# Altium schematic sheet KNoT-Gateway Starter Board.SchDoc: KNoT Gateway Starter Board
size A4; Organization: C.E.S.A.R; Address1: Rua Bione, 220; Address2: Bairro do Recife; Address3: Recife - PE - Brasil; Address4: 50030-390; Revision: 01.00-D01; SheetNumber: 1; SheetTotal: 1
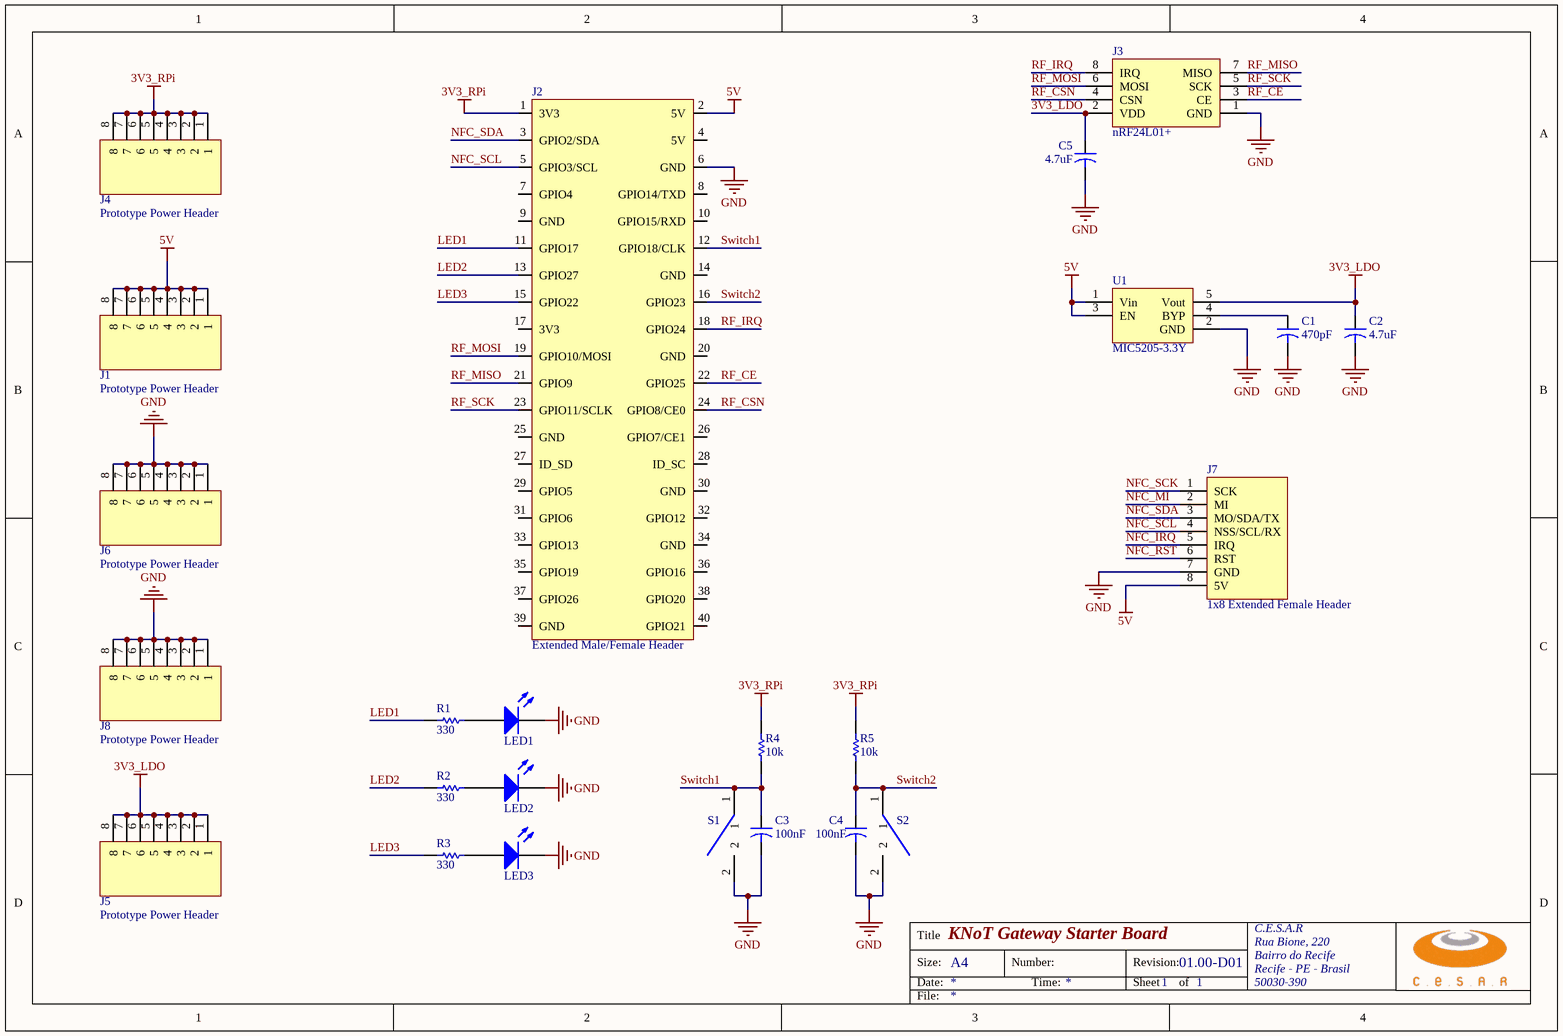
[diagram p0: KNoT-Gateway Starter Board.SchDoc]

## Parts
C1  value 470pF  [CAPC1608L]  (hidden comment: Cap0603)
C2  value 4.7uF  [CAPC1608L]  (hidden comment: Cap0603)
C3  value 100nF  [CAPC1608L]  (hidden comment: Cap0603)
C4  value 100nF  [CAPC1608L]  (hidden comment: Cap0603)
C5  value 4.7uF  [CAPC1608L]  (hidden comment: Cap0603)
J1  Prototype Power Header  [Prototype Holes 1X8]
J2  Extended Male/Female Header  [FEMALE HEADER 2X20]
J3  nRF24L01+  [nRF24L01+PA+LNA]
J4  Prototype Power Header  [Prototype Holes 1X8]
J5  Prototype Power Header  [Prototype Holes 1X8]
J6  Prototype Power Header  [Prototype Holes 1X8]
J7  1x8 Extended Female Header  [NFC_ITEAD_PN532]
J8  Prototype Power Header  [Prototype Holes 1X8]
LED1  LED PTH  [LED PTH]  (value not drawn)
LED2  LED PTH  [LED PTH]  (value not drawn)
LED3  LED PTH  [LED PTH]  (value not drawn)
R1  value 330  [CAPC1608L]  (hidden comment: RES_0402)
R2  value 330  [CAPC1608L]  (hidden comment: RES_0402)
R3  value 330  [CAPC1608L]  (hidden comment: RES_0402)
R4  value 10k  [CAPC1608L]  (hidden comment: RES_0402)
R5  value 10k  [CAPC1608L]  (hidden comment: RES_0402)
S1  200mils Push Button PTH  [Push-Button PTH]  (value not drawn)
S2  200mils Push Button PTH  [Push-Button PTH]  (value not drawn)
U1  MIC5205-3.3Y  [SOT23-5]

## Nets
3V3_LDO: C2.1 C5.1 J3.2(VDD) J5.1 J5.2 J5.3 J5.4 J5.5 J5.6 J5.7 J5.8 U1.5(Vout)
3V3_RPi: J2.1(3V3) J4.1 J4.2 J4.3 J4.4 J4.5 J4.6 J4.7 J4.8 R4.1 R5.1
5V: J1.1 J1.2 J1.3 J1.4 J1.5 J1.6 J1.7 J1.8 J2.2(5V) J7.8(5V) U1.1(Vin) U1.3(EN)
GND: C1.2 C2.2 C3.2 C4.2 C5.2 J2.6(GND) J3.1(GND) J6.1 J6.2 J6.3 J6.4 J6.5 J6.6 J6.7 J6.8 J7.7(GND) J8.1 J8.2 J8.3 J8.4 J8.5 J8.6 J8.7 J8.8 LED1.2(K) LED2.2(K) LED3.2(K) S1.2 S2.2 U1.2(GND)
LED1: J2.11(GPIO17) R1.2
LED2: J2.13(GPIO27) R2.2
LED3: J2.15(GPIO22) R3.2
NFC_IRQ: J7.5(IRQ)
NFC_MI: J7.2(MI)
NFC_RST: J7.6(RST)
NFC_SCK: J7.1(SCK)
NFC_SCL: J2.5(GPIO3/SCL) J7.4(NSS/SCL/RX)
NFC_SDA: J2.3(GPIO2/SDA) J7.3(MO/SDA/TX)
RF_CE: J2.22(GPIO25) J3.3(CE)
RF_CSN: J2.24(GPIO8/CE0) J3.4(CSN)
RF_IRQ: J2.18(GPIO24) J3.8(IRQ)
RF_MISO: J2.21(GPIO9) J3.7(MISO)
RF_MOSI: J2.19(GPIO10/MOSI) J3.6(MOSI)
RF_SCK: J2.23(GPIO11/SCLK) J3.5(SCK)
Switch1: C3.1 J2.12(GPIO18/CLK) R4.2 S1.1
Switch2: C4.1 J2.16(GPIO23) R5.2 S2.1
NetC1_1: C1.1 U1.4(BYP)
NetLED1_1: LED1.1(A) R1.1
NetLED2_1: LED2.1(A) R2.1
NetLED3_1: LED3.1(A) R3.1

Not connected (* = marked no-connect by the designer): J2 4(5V) 7(GPIO4) 8(GPIO14/TXD) 9(GND) 10(GPIO15/RXD) 14(GND) 17(3V3) 20(GND) 25(GND) 26(GPIO7/CE1) 27(ID_SD) 28(ID_SC) 29(GPIO5) 30(GND) 31(GPIO6) 32(GPIO12) 33(GPIO13) 34(GND) 35(GPIO19) 36(GPIO16) 37(GPIO26) 38(GPIO20) 39(GND) 40(GPIO21)

## Notes on the sheet
- Title
- Size:
- Date:
- A4
- Number:
- Time:
- Revision:
- Sheet
- of
- File:

## Library data of the parts
C1-C5 = Cap0603: 4.7µF 10V Ceramic Capacitor X5R 0603; Published: 23-Sep-2002; PackageReference: CC0603KRX5R6BB475; Publisher: Altium Limited; PackageDescription: Capacitor; 2 Leads; Supplier 1: Digi-Key
  C1: Supplier 1 Part Number: 311-1679-1-ND
  C2 C5: Supplier 1 Part Number: 311-1734-1-ND
  C3 C4: Supplier 1 Part Number: 311-1731-1-ND
J2 = RPI2_GPIO: RPi GPIO HEADER 2X20; Supplier 1: Farnell; Supplier Part Number 1: 1933491
J3 = nRF24L01+: nRF24L01 2x4 HEADER; Supplier 1: Digi-Key; Supplier Part Number 1: S7107-ND
J7 = PN532_NFC: Supplier Part Number 1: 1929242; Supplier 1: Farnell
LED1-LED3 = LED 0603: Supplier 1: Digi-Key; Supplier Part Number 1: C503B-RCN-CW0Z0AA1-ND
R1-R5 = RES_0402: Precision Thick Film Chip Resistor, 10 Ohm to 1M Ohm Range, 1% and 0.5% Tolerance, 0805 Size, 1/8 W; Supplier 1: Digi-Key
  R1-R3: Supplier 1 Part Number: 311-270JRCT-ND
  R4 R5: Supplier 1 Part Number: 311-2131-1-ND
S1 S2 = Push-Button PTH: Push Button; Supplier 1: Digi-Key; Supplier Part Number 1: EG2605-ND
U1 = MIC5205-3V3: MIC5205-3.3Y LDO; Supplier 1: Digi-Key; Supplier Part Number 1: 576-1259-1-ND